# Altium schematic sheet 485.SchDoc
size A3
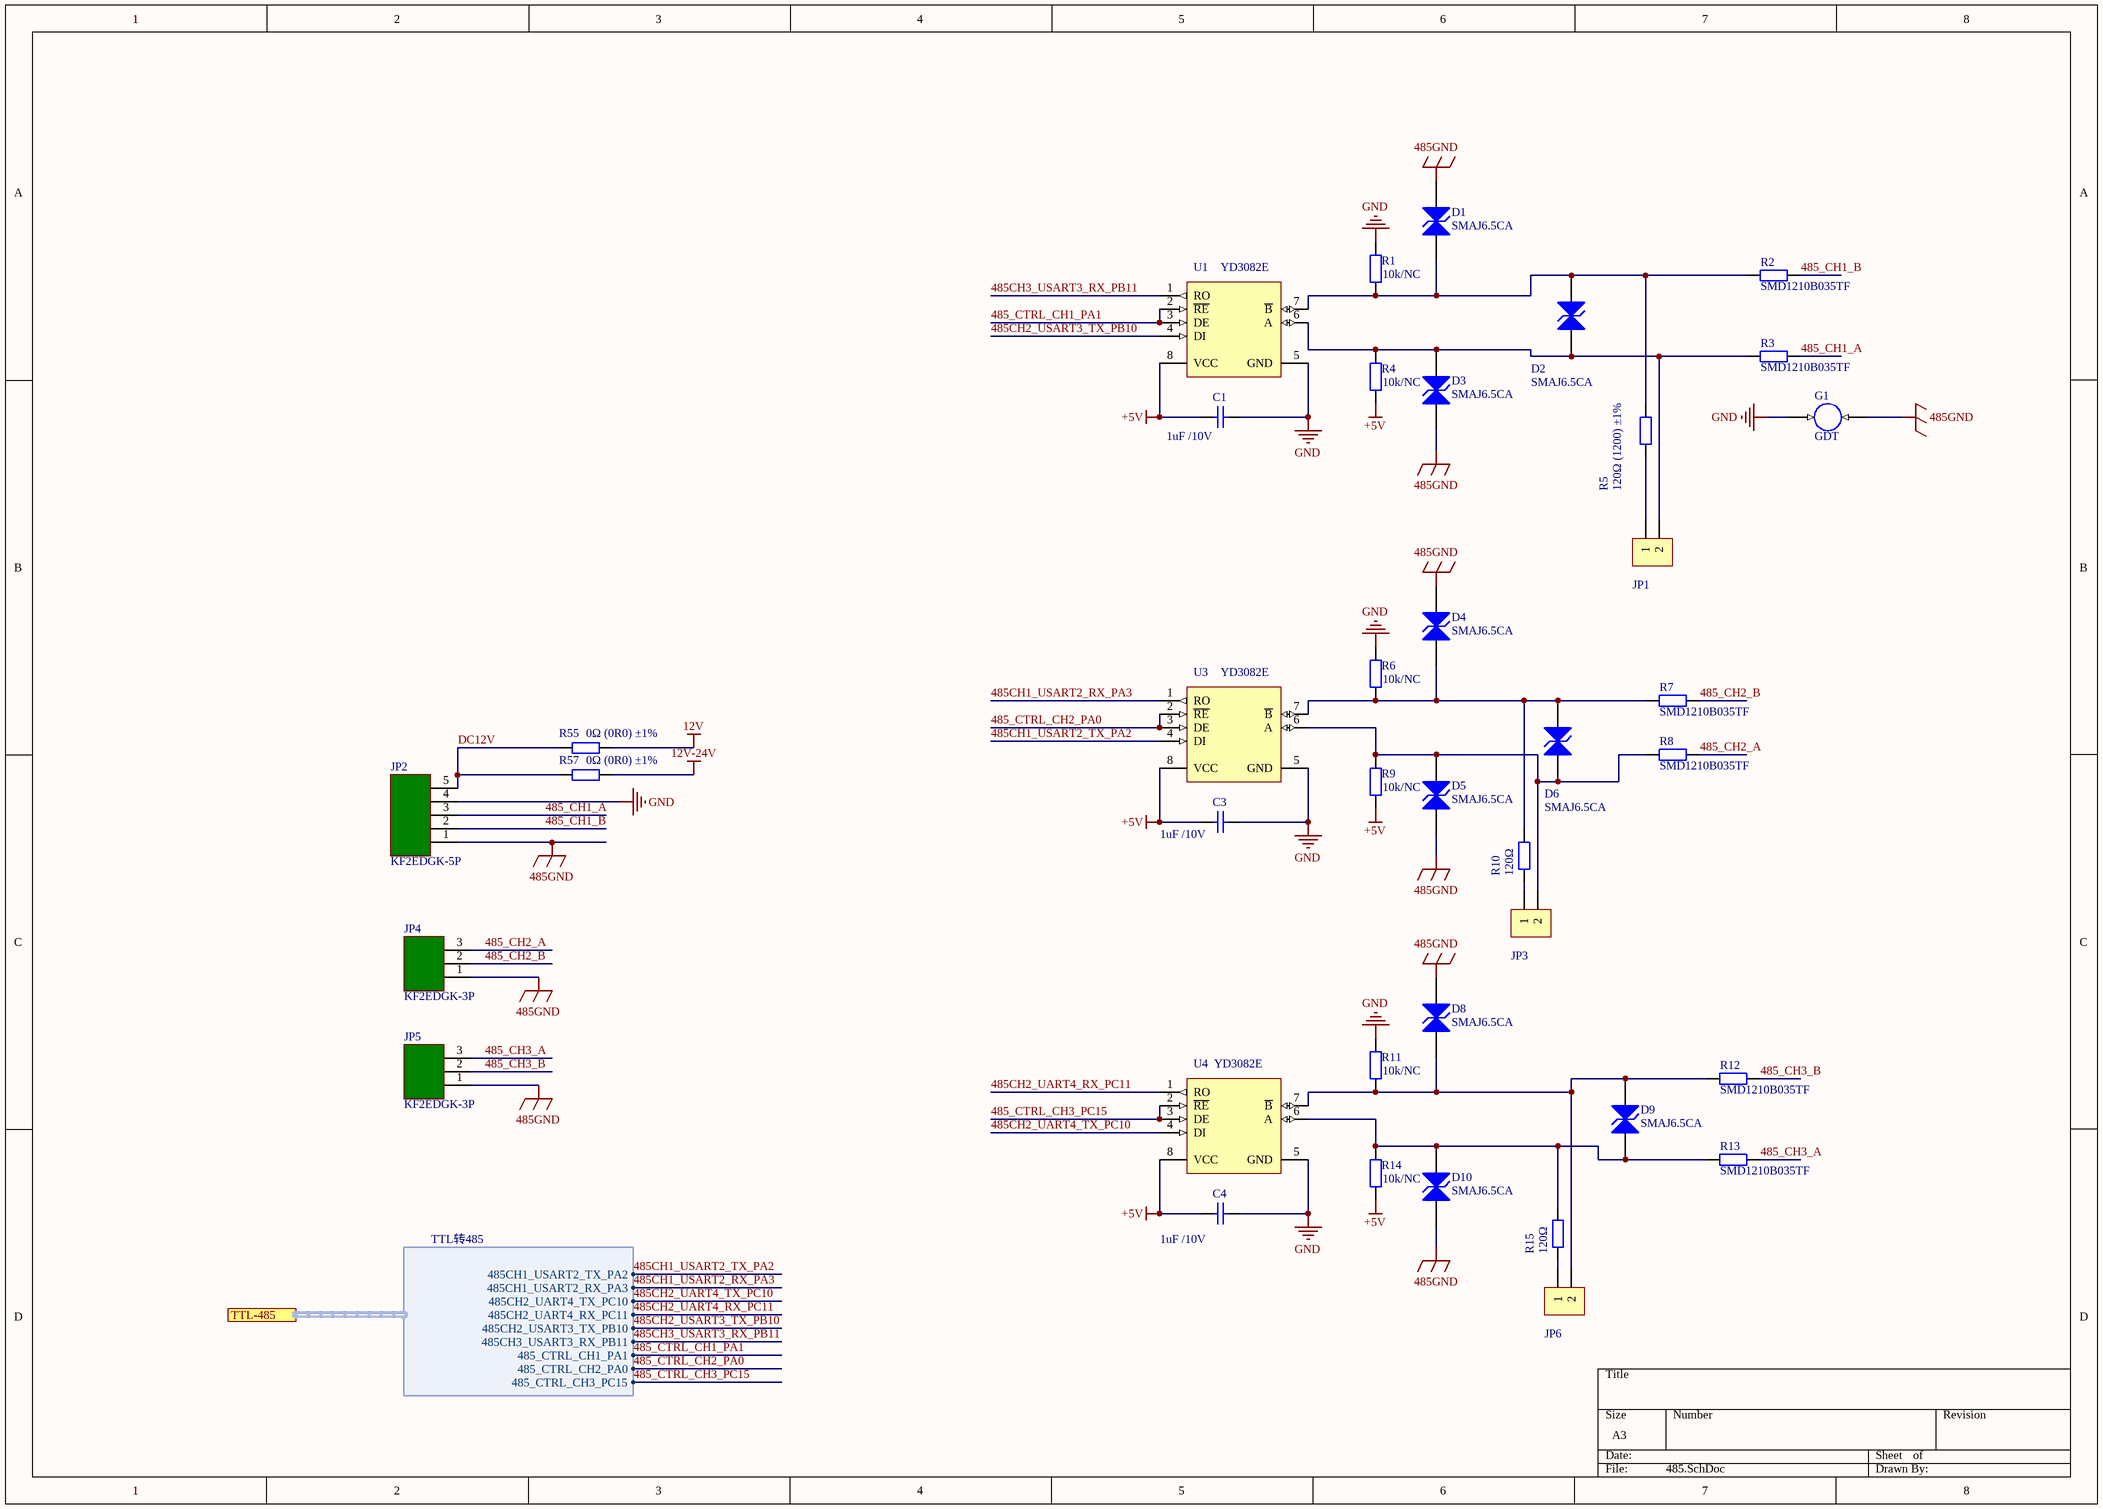
[diagram p0: 485.SchDoc]

## Parts
C1  1uF /10V  [0603_C]
C3  1uF /10V  [0603_C]
C4  1uF /10V  [0603_C]
D1  SMAJ6.5CA  [SMA(DO-214AC)_S1]
D2  SMAJ6.5CA  [SMA(DO-214AC)_S1]
D3  SMAJ6.5CA  [SMA(DO-214AC)_S1]
D4  SMAJ6.5CA  [SMA(DO-214AC)_S1]
D5  SMAJ6.5CA  [SMA(DO-214AC)_S1]
D6  SMAJ6.5CA  [SMA(DO-214AC)_S1]
D8  SMAJ6.5CA  [SMA(DO-214AC)_S1]
D9  SMAJ6.5CA  [SMA(DO-214AC)_S1]
D10  SMAJ6.5CA  [SMA(DO-214AC)_S1]
G1  GDT  [GDT]
JP1  HDR-1X2  [HDR-1X2]  (value not drawn)
JP2  KF2EDGK-5P  [KF2EDGK5.08W-5P]
JP3  HDR-1X2  [HDR-1X2]  (value not drawn)
JP4  KF2EDGK-3P  [KF2EDGK5.08W-3P]
JP5  KF2EDGK-3P  [KF2EDGK5.08W-3P]
JP6  HDR-1X2  [HDR-1X2]  (value not drawn)
R1  10k/NC  [0603_R]
R2  SMD1210B035TF  [1206_R]
R3  SMD1210B035TF  [1206_R]
R4  10k/NC  [0603_R]
R5  120Ω (1200) ±1%  [0603_R]
R6  10k/NC  [0603_R]
R7  SMD1210B035TF  [1206_R]
R8  SMD1210B035TF  [1206_R]
R9  10k/NC  [0603_R]
R10  120Ω  [0603_R]
R11  10k/NC  [0603_R]
R12  SMD1210B035TF  [1206_R]
R13  SMD1210B035TF  [1206_R]
R14  10k/NC  [0603_R]
R15  120Ω  [0603_R]
R55  0Ω (0R0) ±1%  [1206_R]
R57  0Ω (0R0) ±1%  [1206_R]
U1  YD3082E  [SOIC-8_150mil]
U3  YD3082E  [SOIC-8_150mil]
U4  YD3082E  [SOIC-8_150mil]

## Ports
TTL-485 (harness TTL转485)

## Harnesses
TTL转485: 485CH1_USART2_TX_PA2, 485CH1_USART2_RX_PA3, 485CH2_UART4_TX_PC10, 485CH2_UART4_RX_PC11, 485CH2_USART3_TX_PB10, 485CH3_USART3_RX_PB11, 485_CTRL_CH1_PA1, 485_CTRL_CH2_PA0, 485_CTRL_CH3_PC15

## Nets
12V: R55.1
12V-24V: R57.1
485GND: D1.1(A) D3.1(A) D4.1(A) D5.1(A) D8.1(A) D10.1(A) G1.1 JP2.1 JP4.1 JP5.1
+5V: C1.1 C3.1 C4.1 R4.1 R9.1 R14.1 U1.8(VCC) U3.8(VCC) U4.8(VCC)
GND: C1.2 C3.2 C4.2 G1.2 JP2.4 R1.2 R6.2 R11.2 U1.5(GND) U3.5(GND) U4.5(GND)
485_CH1_A: JP2.3 R3.2
485_CH1_B: JP2.2 R2.2
485_CH2_A: JP4.3 R8.2
485_CH2_B: JP4.2 R7.2
485_CH3_A: JP5.3 R13.2
485_CH3_B: JP5.2 R12.2
485_CTRL_CH1_PA1: U1.2(~{RE}) U1.3(DE) ; port TTL-485.485_CTRL_CH1_PA1
485_CTRL_CH2_PA0: U3.2(~{RE}) U3.3(DE) ; port TTL-485.485_CTRL_CH2_PA0
485_CTRL_CH3_PC15: U4.2(~{RE}) U4.3(DE) ; port TTL-485.485_CTRL_CH3_PC15
485CH1_USART2_RX_PA3: U3.1(RO) ; port TTL-485.485CH1_USART2_RX_PA3
485CH1_USART2_TX_PA2: U3.4(DI) ; port TTL-485.485CH1_USART2_TX_PA2
485CH2_UART4_RX_PC11: U4.1(RO) ; port TTL-485.485CH2_UART4_RX_PC11
485CH2_UART4_TX_PC10: U4.4(DI) ; port TTL-485.485CH2_UART4_TX_PC10
485CH2_USART3_TX_PB10: U1.4(DI) ; port TTL-485.485CH2_USART3_TX_PB10
485CH3_USART3_RX_PB11: U1.1(RO) ; port TTL-485.485CH3_USART3_RX_PB11
DC12V: JP2.5 R55.2 R57.2
NetD1_2: D1.2(K) D2.1(A) R1.1 R2.1 R5.1 U1.7(~{B})
NetD2_2: D2.2(K) D3.2(K) JP1.2 R3.1 R4.2 U1.6(A)
NetD4_2: D4.2(K) D6.1(A) R6.1 R7.1 R10.2 U3.7(~{B})
NetD5_2: D5.2(K) D6.2(K) JP3.2 R8.1 R9.2 U3.6(A)
NetD8_2: D8.2(K) D9.1(A) JP6.2 R11.1 R12.1 U4.7(~{B})
NetD9_2: D9.2(K) D10.2(K) R13.1 R14.2 R15.2 U4.6(A)
NetJP1_1: JP1.1 R5.2
NetJP3_1: JP3.1 R10.1
NetJP6_1: JP6.1 R15.1

## Library data of the parts
C1 C3 C4 = 0603 100nF (104) 10% 50V: 贴片电容; ComponentLink1Description: 供应商链接; ComponentLink1URL: http://www.szlcsc.com/product/details_15331.html; Package: 0603; Supplier: LC; SuppliersPartNumber: C14663
D1-D6 D8-D10 = SMB/DO-214AA P6SMB6.8CA: TVS; ComponentLink1Description: 供应商链接; ComponentLink1URL: http://www.szlcsc.com/product/details_79530.html; Package: SMB/DO-214AA; Supplier: LC; SuppliersPartNumber: C78395
G1 = GDT: 放电管
JP1 JP3 JP6 = Header 2: 2P接插件; 版权归属: 源创客; BOM名称: 2P接插件; 学习资源: www.ooocke.com
R1 R4 R6 R9 R11 R14 = 0603 3.3KΩ (3301) 1%: 贴片电阻; ComponentLink1Description: 供应商链接; ComponentLink1URL: http://www.szlcsc.com/product/details_23705.html; Package: 0603; Supplier: LC; SuppliersPartNumber: C22978
R2 R3 R7 R8 R12 R13 R55 R57 = 1206 0Ω (0R0) 1%: 贴片电阻; ComponentLink1Description: 供应商链接; ComponentLink1URL: http://www.szlcsc.com/product/details_18576.html; Package: 1206; Supplier: LC; SuppliersPartNumber: C17888
R5 R10 R15 = 0603 120Ω (1200) 1%: 贴片电阻; ComponentLink1Description: 供应商链接; ComponentLink1URL: http://www.szlcsc.com/product/details_23514.html; Package: 0603; Supplier: LC; SuppliersPartNumber: C22787
U1 U3 U4 = SP485EEN-L/TR: RS-485/RS-422; ComponentLink1Description: 供应商链接; ComponentLink1URL: http://www.szlcsc.com/product/details_7327.html; Package: SOIC-8; Supplier: LC; SuppliersPartNumber: C6855